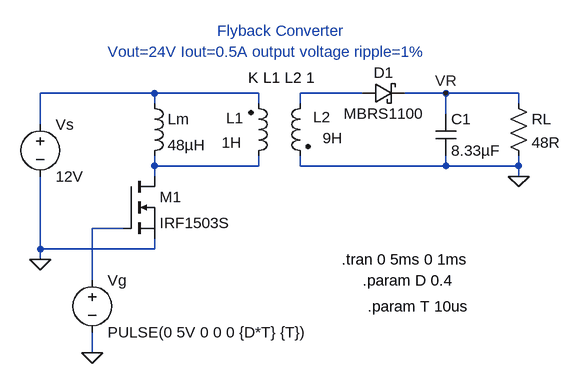
[diagram p0: schematic flyback.asc]
flyback.asc, the LTspice schematic file:
Version 4
SHEET 1 880 680
WIRE 80 112 -96 112
WIRE 240 112 80 112
WIRE 400 112 304 112
WIRE 528 112 464 112
WIRE 640 112 528 112
WIRE 80 128 80 112
WIRE 240 128 240 112
WIRE 304 128 304 112
WIRE 640 128 640 112
WIRE 528 144 528 112
WIRE -96 160 -96 112
WIRE 80 224 80 208
WIRE 240 224 240 208
WIRE 240 224 80 224
WIRE 304 224 304 208
WIRE 528 224 528 208
WIRE 528 224 304 224
WIRE 640 224 640 208
WIRE 640 224 528 224
WIRE 80 240 80 224
WIRE 640 240 640 224
WIRE 32 320 -16 320
WIRE -96 352 -96 240
WIRE 80 352 80 336
WIRE 80 352 -96 352
WIRE -96 368 -96 352
WIRE -16 400 -16 320
WIRE -16 512 -16 480
FLAG -96 368 0
FLAG -16 512 0
FLAG 528 112 VR
FLAG 640 240 0
SYMBOL ind2 224 224 M180
WINDOW 0 -34 74 Left 2
WINDOW 3 -41 36 Left 2
SYMATTR InstName L1
SYMATTR Value 1H
SYMATTR Type ind
SYMBOL ind2 320 112 M0
WINDOW 0 -31 37 Left 2
WINDOW 3 -49 69 Left 2
SYMATTR InstName L2
SYMATTR Value 9H
SYMATTR Type ind
SYMBOL schottky 400 128 R270
WINDOW 0 32 32 VTop 2
WINDOW 3 0 32 VBottom 2
SYMATTR InstName D1
SYMATTR Value MBRS1100
SYMATTR Description Diode
SYMATTR Type diode
SYMBOL res 624 112 R0
SYMATTR InstName RL
SYMATTR Value 48R
SYMBOL voltage -96 144 R0
SYMATTR InstName Vs
SYMATTR Value 12V
SYMBOL nmos 32 240 R0
SYMATTR InstName M1
SYMATTR Value IRF1503S
SYMBOL voltage -16 384 R0
WINDOW 123 0 0 Left 2
WINDOW 39 0 0 Left 2
SYMATTR InstName Vg
SYMATTR Value PULSE(0 5V 0 0 0 {D*T} {T})
SYMBOL cap 512 144 R0
SYMATTR InstName C1
SYMATTR Value 8.33µF
SYMBOL ind 64 112 R0
SYMATTR InstName Lm
SYMATTR Value 48µH
TEXT 368 368 Left 2 !.tran 0 5ms 0 1ms
TEXT 224 88 Left 2 !K L1 L2 1
TEXT 400 400 Left 2 !.param D 0.4
TEXT 408 440 Left 2 !.param T 10us
TEXT 176 16 Left 2 ;Flyback Converter
TEXT 8 48 Left 2 ;Vout=24V Iout=0.5A output voltage ripple=1%

The netlist it stands for:
* flyback.asc
L1 N003 N001 1H
L2 N002 0 9H
D1 N002 VR MBRS1100
RL VR 0 48R
Vs N001 0 12V
M1 N003 N004 0 0 IRF1503S
Vg N004 0 PULSE(0 5V 0 0 0 {D*T} {T})
C1 VR 0 8.33µF
Lm N001 N003 48µH
.model D D
.lib standard.dio
.model NMOS NMOS
.model PMOS PMOS
.lib standard.mos
.tran 0 5ms 0 1ms
K L1 L2 1
.param D 0.4
.param T 10us
* Flyback Converter
* Vout=24V Iout=0.5A output voltage ripple=1%
.backanno
.end